# Altium schematic sheet Power.SchDoc
size A3
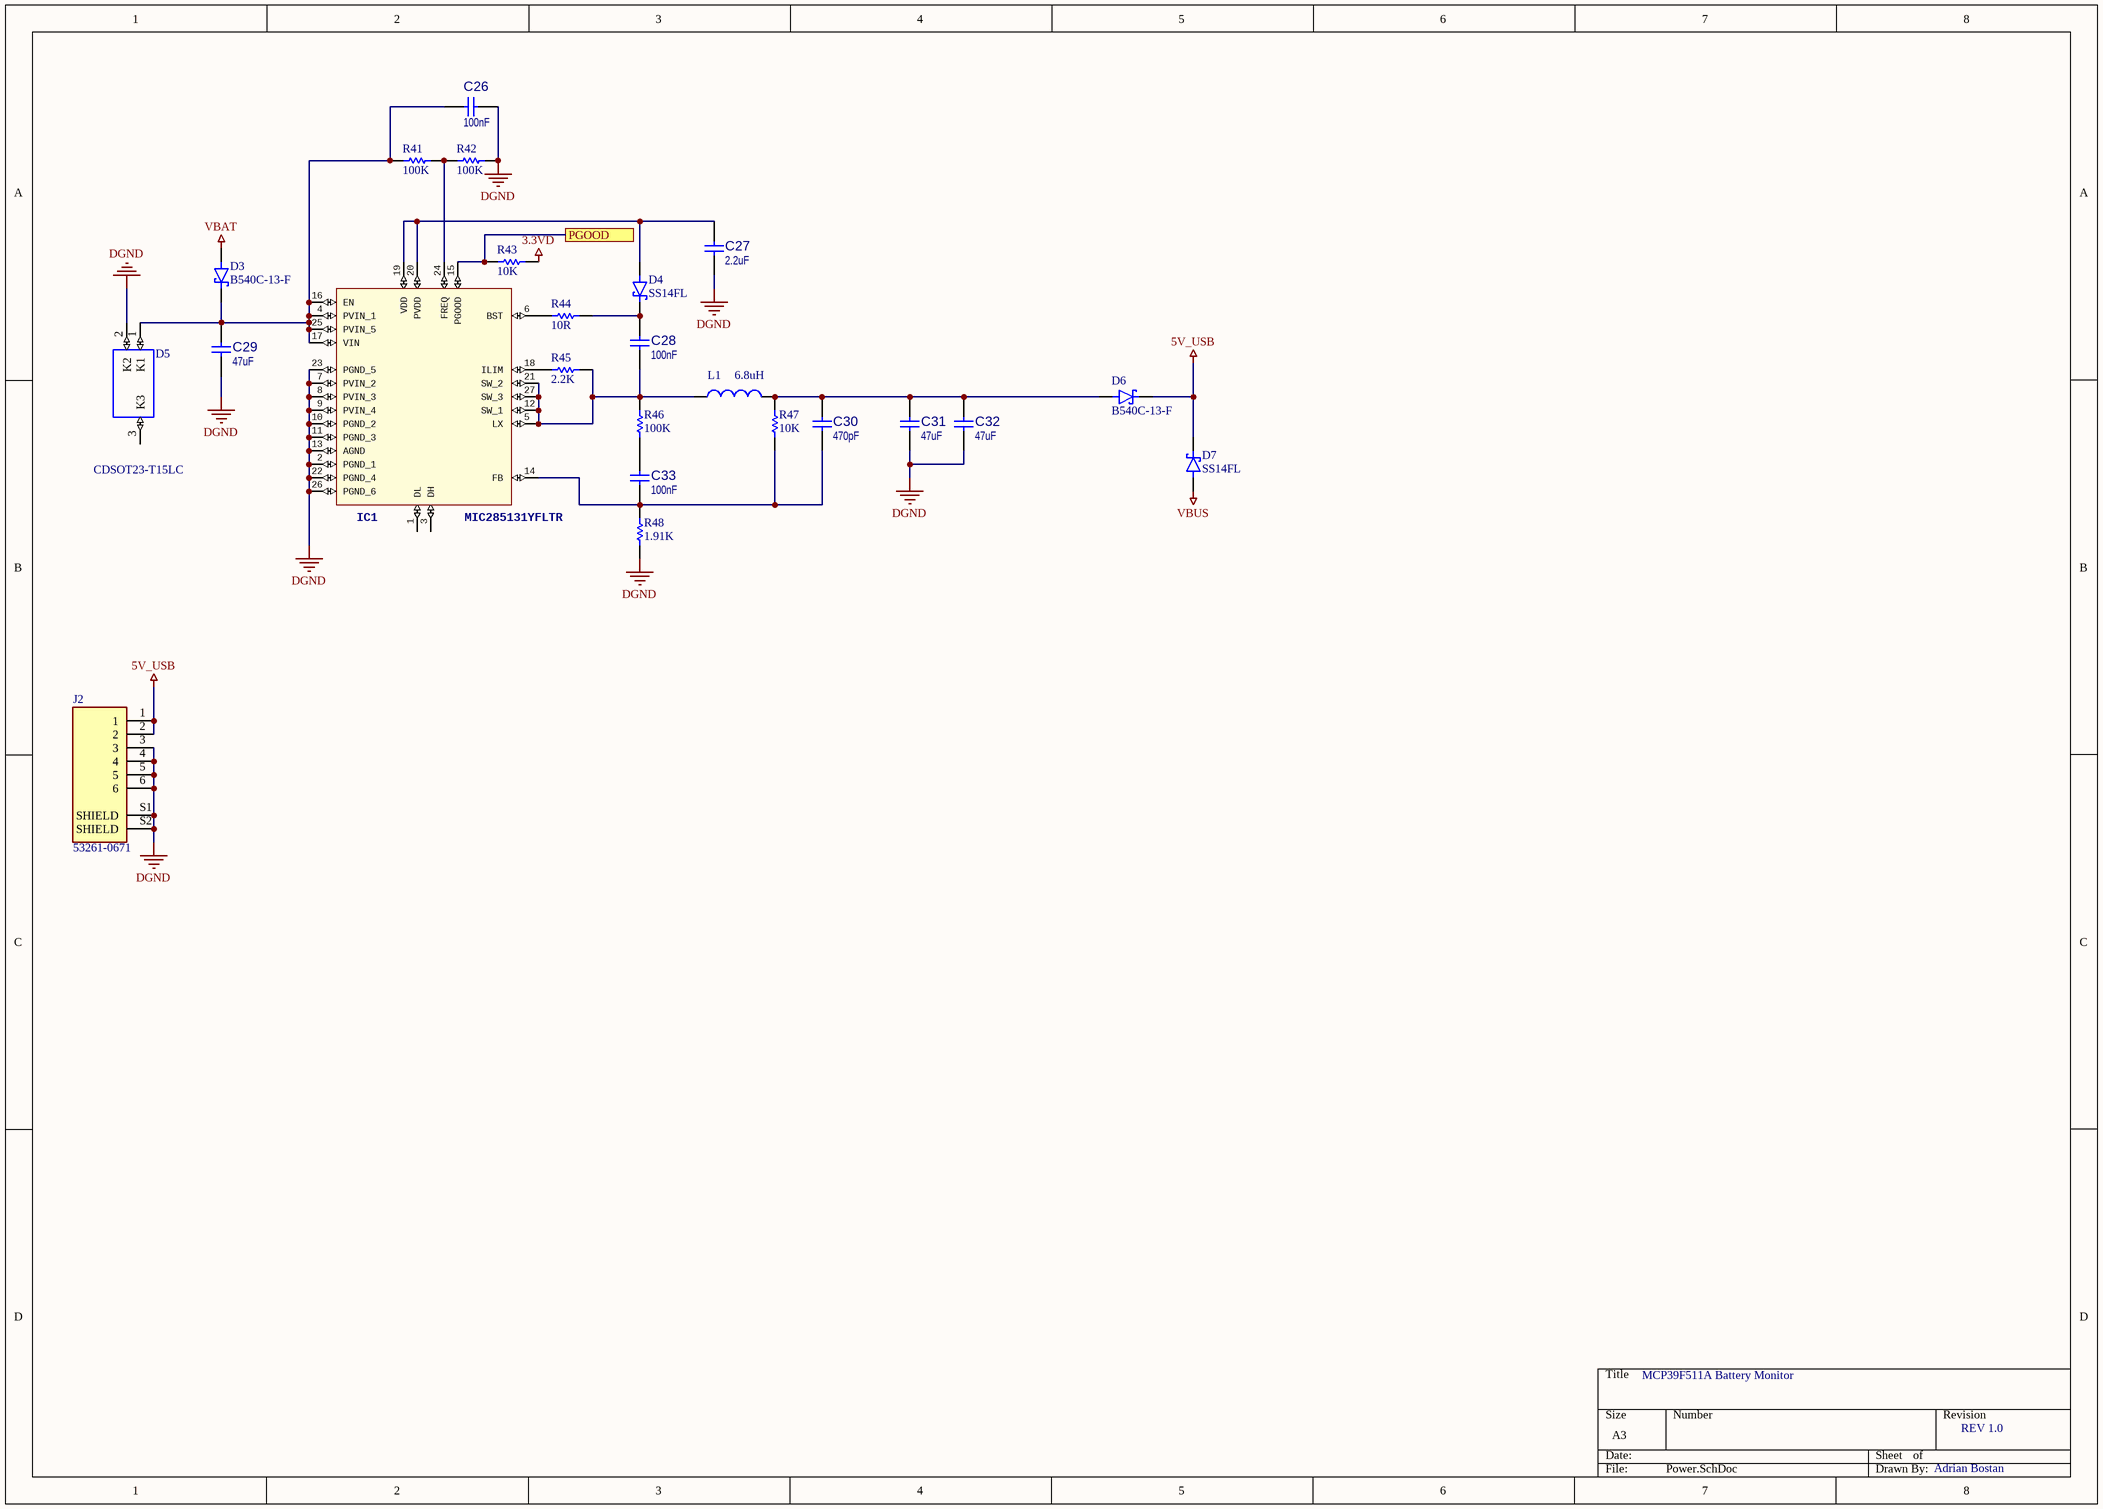
[diagram p0: Power.SchDoc]

## Parts
C26  value 100nF  [CAP0603M]
C27  value 2.2uF  [CAP0603M]
C28  value 100nF  [CAP0603M]
C29  value 47uF  [Tantal D]
C30  value 470pF  [CAP0603M]
C31  value 47uF  [Tantal D]
C32  value 47uF  [Tantal D]
C33  value 100nF  [CAP0603M]
D3  B540C-13-F  [B540C-13-F]
D4  SS14FL  [SODFL3617X108N]
D5  CDSOT23-T15LC  [SOT95P230X117-3N]
D6  B540C-13-F  [B540C-13-F]
D7  SS14FL  [SODFL3617X108N]
IC1  MIC285131YFLTR  [MIC285131YFLTR]
J2  53261-0671  [53261-0671]
L1  value 6.8uH  [SRR1050A-6R8Y]  (hidden comment: SRR1050A-6R8Y)
R41  value 100K  [RES0603M]  (hidden comment: Res1)
R42  value 100K  [RES0603M]  (hidden comment: Res1)
R43  value 10K  [RES0603M]  (hidden comment: Res1)
R44  value 10R  [RES0603M]  (hidden comment: Res1)
R45  value 2.2K  [RES0603M]  (hidden comment: Res1)
R46  value 100K  [RES0603M]  (hidden comment: Res1)
R47  value 10K  [RES0603M]  (hidden comment: Res1)
R48  value 1.91K  [RES0603M]  (hidden comment: Res1)

## Ports
PGOOD

## Nets
3.3VD: R43.1
5V_USB: D6.C(K) D7.C(K) J2.1 J2.2
DGND: C26.1 C27.1 C29.1 C31.1 C32.1 D5.2(K2) IC1.2(PGND_1) IC1.7(PVIN_2) IC1.8(PVIN_3) IC1.9(PVIN_4) IC1.10(PGND_2) IC1.11(PGND_3) IC1.13(AGND) IC1.22(PGND_4) IC1.23(PGND_5) IC1.26(PGND_6) J2.3 J2.4 J2.5 J2.6 J2.S1(SHIELD) J2.S2(SHIELD) R42.1 R48.2
VBAT: D3.A
VBUS: D7.A
PGOOD: IC1.15(PGOOD) R43.2 ; port PGOOD
NetC26_2: C26.2 C29.2 D3.C(K) D5.1(K1) IC1.4(PVIN_1) IC1.16(EN) IC1.17(VIN) IC1.25(PVIN_5) R41.2
NetC27_2: C27.2 D4.A IC1.19(VDD) IC1.20(PVDD)
NetC28_1: C28.1 IC1.5(LX) IC1.12(SW_1) IC1.21(SW_2) IC1.27(SW_3) L1.1 R45.1 R46.1
NetC28_2: C28.2 D4.C(K) R44.1
NetC30_1: C30.1 C33.1 IC1.14(FB) R47.2 R48.1
NetC30_2: C30.2 C31.2 C32.2 D6.A L1.2 R47.1
NetC33_2: C33.2 R46.2
NetIC1_6: IC1.6(BST) R44.2
NetIC1_18: IC1.18(ILIM) R45.2
NetIC1_24: IC1.24(FREQ) R41.1 R42.2

Not connected (* = marked no-connect by the designer): D5 3(K3); IC1 1(DL) 3(DH)

## Notes on the sheet
- MCP39F511A Battery Monitor
- REV 1.0
- Adrian Bostan

## Library data of the parts
C26-C33 = CAP1183: Capacitor; Manufacturer 1: Murata Electronics North America; Manufacturer Part Number 1: GRM155R61A105KE15D; Description_: CAP CER 1uF 10V 10% X5R SMD 0402; Dev Tools Status: Production; Tolerance: 10%; Temperature Coeffcient: X5R; Type: Ceramic; Owner: Aaron VanDuerm; Populated: YES; MCHP-ID: CAP1183; Revision: 0; Symbol: Capacitor NP; Status: MCL Design; ComponentLink1URL: https://chn-vm-apps.microchip.com/mchprepo/parts/Datasheets/CL05A105KP5NNNC1.pdf; ComponentLink1Description: SVN Datasheet; ComponentLink2URL: C:\ALTIUM_WORK\00001_MCHP-CDB\Datasheets\CL05A105KP5NNNC1.pdf; ComponentLink2Description: Local Datasheet; ComponentLink3URL: C:\ALTIUM_WORK\00001_MCHP-CDB\Library\LibraryRefs\Capacitor NP.SchLib; ComponentLink3Description: Open Symbol; ComponentLink4URL: C:\ALTIUM_WORK\00001_MCHP-CDB\Library\Footprints\CAP_C_0402.PcbLib; ComponentLink4Description: Open Footprint; ComponentLink5Description: Open Footprint 2; ComponentLink6Description: Open Footprint 3; ComponentLink7Description: Open Footprint 4; Operating Temperature: -55C to +85C; Category: Capacitor; Supplier 1: Digi-Key; Supplier Part Number 1: 490-3890-1-ND; Quantity Override: 1; Manufacturer 2: Samsung; Manufacturer Part Number 2: CL05A105KP5NNNC; Supplier 2: Digi-Key; Supplier Part Number 2: 1276-1076-2-ND
D3 D6 = B540C-13-F: Diode Schottky 40V 5A Surface Mount SMC; MF: Multicomp; MP: B540C-13-F; SnapEDA_Link: https://www.snapeda.com/parts/B540C-13-F/Multicomp/view-part/588851/?ref=snap; Value: *; Package: DO-214 Multicomp; Price: None; Availability: Unavailable
D4 D7 = SS14FL: Diode Schottky 40V 1A Surface Mount SOD-123F; MF: ON Semiconductor; Value: *; Digi-Key_Part_Number: SS14FLCT-ND; Package: SOD-123F ON Semiconductor; Digi-Key_Purchase_URL: https://www.digikey.com/product-detail/en/on-semiconductor/SS14FL/SS14FLCT-ND/5305092?utm_source=snapeda&utm_medium=aggregator&utm_campaign=symbol; SnapEDA_Link: https://www.snapeda.com/parts/SS14FL/ON%20Semiconductor/view-part/2651388/?ref=snap; MP: SS14FL
D5 = CDSOT23-T24CAN: 40V Clamp 8A _8/20Âµs_ Ipp Tvs Diode Surface Mount SOT-23; MF: Bourns; Package: SOT-23-3 Bourns; MP: CDSOT23-T24CAN; SnapEDA_Link: https://www.snapeda.com/parts/CDSOT23-T24CAN/Bourns/view-part/501962/?ref=snap; Price: None; Value: *; Availability: Unavailable
IC1 = MIC28513-1YFL-TR: Manufacturer_Name: Microchip; Manufacturer_Part_Number: MIC28513-1YFL-TR; Mouser_Part_Number: 998-MIC28513-1YFLTR; Mouser_Price-Stock: https://www.mouser.com/Search/Refine.aspx?Keyword=998-MIC28513-1YFLTR; Height: 0.95mm
J2 = 53261-0671: Picoblade Connector, 6 Circuit Single Row, Right Angle Surface Mount SMT PCB; MP: 0532610671; MF: Molex; SnapEDA_Link: https://www.snapeda.com/parts/0532610671/Molex/view-part/523089/?ref=snap; Package: None; Value: *; Digi-Key_Part_Number: WM7624CT-ND; Digi-Key_Purchase_URL: https://www.digikey.com/product-detail/en/molex/0532610671/WM7624CT-ND/699111?utm_source=snapeda&utm_medium=aggregator&utm_campaign=symbol
L1 = Inductor: Code_IEC: 1005; Published: 8-Jun-2000; LatestRevisionDate: 29-May-2009; LatestRevisionNote: IPC-7351 Footprint Added.; PackageReference: 0402-A; Publisher: Altium Limited; PackageDescription: Chip Inductor; Code_JEITA: 0402
R41-R48 = Res1: Resistor; Published: 8-Jun-2000; LatestRevisionDate: 17-Jul-2002; LatestRevisionNote: Re-released for DXP Platform.; PackageReference: AXIAL-0.3; Publisher: Altium Limited; PackageDescription: Axial Device, Thru-Hole; 2 Leads; 0.3 in Pin Spacing